# EAGLE design Comm&Log (EAGLE 9.6.2)
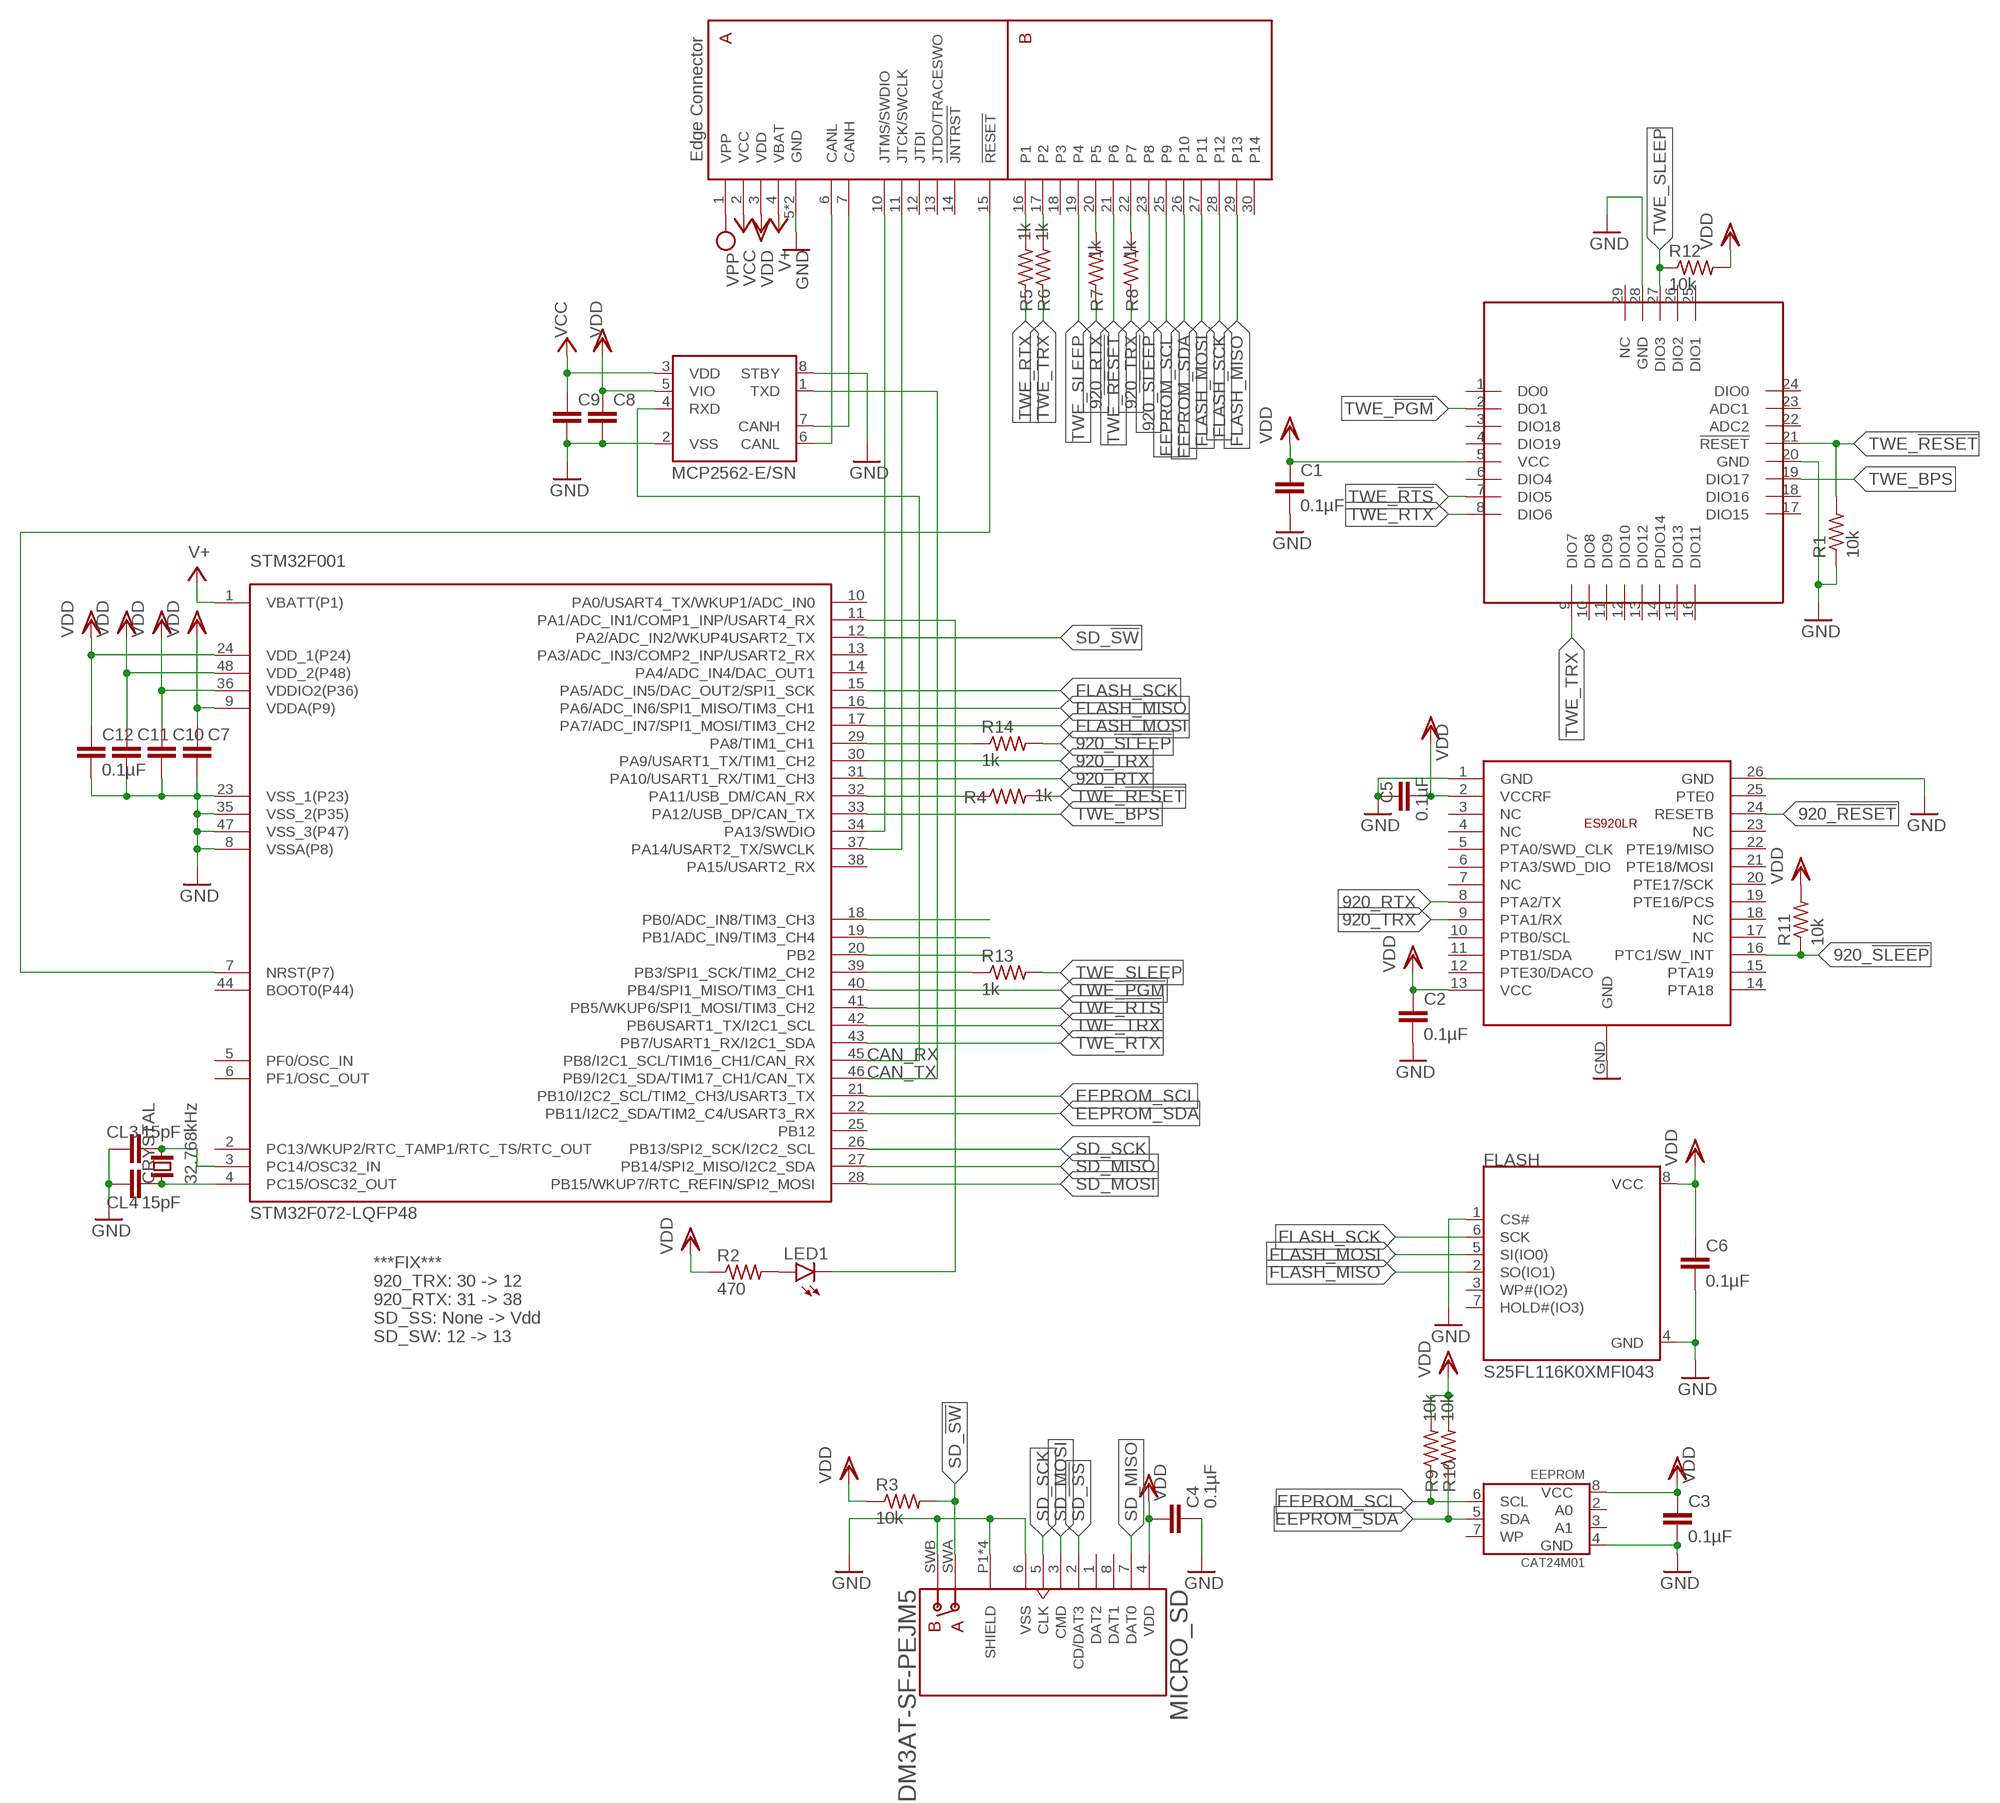
[diagram p0: schematic, sheet 1]

## Parts
C1  0.1µF  C-EUC0603K  [C0603K]
C2  0.1µF  C-EUC0603K  [C0603K]
C3  0.1µF  C-EUC0603K  [C0603K]
C4  0.1µF  C-EUC0603K  [C0603K]
C5  0.1µF  C-EUC0603K  [C0603K]
C6  0.1µF  C-EUC0603K  [C0603K]
C7  C-EUC0603K  [C0603K]
C8  C-EUC0603K  [C0603K]
C9  C-EUC0603K  [C0603K]
C10  C-EUC0603K  [C0603K]
C11  C-EUC0603K  [C0603K]
C12  0.1µF  C-EUC0603K  [C0603K]
CL3  15pF  C-EUC0603K  [C0603K]
CL4  15pF  C-EUC0603K  [C0603K]
CRYSTAL  32.768kHz  CRYTALFC-255  [FC-255]
EEPROM  CAT24M01  [SO-8]
ES920LR  ES920LR  [ES920LR]
FLASH  S25FL116K0XMFI043  [SOIC127P600X175-8N]
LED1  LEDCHIP-LED0603  [CHIP-LED0603]
MCP1  MCP2562-E/SN  [SOIC127P600X175-8N]
MICRO_SD  DM3AT-SF-PEJM5  [HRS_DM3AT-SF-PEJM5]
R1  10k  R-US_R0603  [R0603]
R2  470  R-US_R0603  [R0603]
R3  10k  R-US_R0603  [R0603]
R4  1k  R-US_R0603  [R0603]
R5  1k  R-US_R0603  [R0603]
R6  1k  R-US_R0603  [R0603]
R7  1k  R-US_R0603  [R0603]
R8  1k  R-US_R0603  [R0603]
R9  10k  R-US_R0603  [R0603]
R10  10k  R-US_R0603  [R0603]
R11  10k  R-US_R0603  [R0603]
R12  10k  R-US_R0603  [R0603]
R13  1k  R-US_R0603  [R0603]
R14  1k  R-US_R0603  [R0603]
STM32F001  STM32F072-LQFP48  [LQFP48]
TWE-LITE  LITE  [LITE]
U$2  EDGE30  [EDGE30]

## Nets
920_!RESET!: ES920LR.24(RESETB)
920_!SLEEP!: ES920LR.16(PTC1/SW_INT) R11.1 R14.2 U$2.23(P8)
920_!SLEEP!': R14.1 STM32F001.29(PA8/TIM1_CH1)
920_RTX: ES920LR.8(PTA2/TX) R7.1 STM32F001.31(PA10/USART1_RX/TIM1_CH3)
920_RTX_: R7.2 U$2.20(P5)
920_TRX: ES920LR.9(PTA1/RX) R8.1 STM32F001.30(PA9/USART1_TX/TIM1_CH2)
920_TRX_: R8.2 U$2.22(P7)
CAN_RX: MCP1.4(RXD) STM32F001.45(PB8/I2C1_SCL/TIM16_CH1/CAN_RX)
CAN_TX: MCP1.1(TXD) STM32F001.46(PB9/I2C1_SDA/TIM17_CH1/CAN_TX)
CANH1: MCP1.7(CANH) U$2.7(CANH)
CANL1: MCP1.6(CANL) U$2.6(CANL)
EEPROM_SCL: EEPROM.6(SCL) R9.1 STM32F001.21(PB10/I2C2_SCL/TIM2_CH3/USART3_TX) U$2.25(P9)
EEPROM_SDA: EEPROM.5(SDA) R10.1 STM32F001.22(PB11/I2C2_SDA/TIM2_C4/USART3_RX) U$2.26(P10)
FLASH_MISO: FLASH.2(SO(IO1)) STM32F001.16(PA6/ADC_IN6/SPI1_MISO/TIM3_CH1) U$2.29(P13)
FLASH_MOSI: FLASH.5(SI(IO0)) STM32F001.17(PA7/ADC_IN7/SPI1_MOSI/TIM3_CH2) U$2.27(P11)
FLASH_SCK: FLASH.6(SCK) STM32F001.15(PA5/ADC_IN5/DAC_OUT2/SPI1_SCK) U$2.28(P12)
GND: C1.2 C2.2 C3.2 C4.2 C5.1 C6.2 C7.2 C8.2 C9.2 C10.2 C11.2 C12.2 CL3.1 CL4.1 EEPROM.4(GND) ES920LR.1(GND) ES920LR.26(GND) ES920LR.GND FLASH.1(CS#) FLASH.4(GND) MCP1.2(VSS) MCP1.8(STBY) MICRO_SD.6(VSS) MICRO_SD.P1(SHIELD) MICRO_SD.P2(SHIELD) MICRO_SD.P3(SHIELD) MICRO_SD.P4(SHIELD) MICRO_SD.SWB(B) R1.1 STM32F001.8(VSSA(P8)) STM32F001.23(VSS_1(P23)) STM32F001.35(VSS_2(P35)) STM32F001.47(VSS_3(P47)) TWE-LITE.20(GND) TWE-LITE.28(GND) U$2.5(GND) U$2.8(GND)
N$3: R4.1 STM32F001.32(PA11/USB_DM/CAN_RX)
N$4: R6.2 U$2.17(P2)
N$6: R13.1 STM32F001.39(PB3/SPI1_SCK/TIM2_CH2)
N$62: STM32F001.18(PB0/ADC_IN8/TIM3_CH3)
N$63: STM32F001.19(PB1/ADC_IN9/TIM3_CH4)
N$64: STM32F001.20(PB2)
N$71: CL4.2 CRYSTAL.1 STM32F001.4(PC15/OSC32_OUT)
N$72: CL3.2 CRYSTAL.2 STM32F001.3(PC14/OSC32_IN)
N$73: LED1.C STM32F001.11(PA1/ADC_IN1/COMP1_INP/USART4_RX)
N$74: R5.2 U$2.16(P1)
N$76: LED1.A R2.2
NRST1: STM32F001.7(NRST(P7)) U$2.15(!RESET!)
SD_!SS!: MICRO_SD.2(CD/DAT3)
SD_!SW!: MICRO_SD.SWA(A) R3.2 STM32F001.12(PA2/ADC_IN2/WKUP4USART2_TX)
SD_MISO: MICRO_SD.7(DAT0) STM32F001.27(PB14/SPI2_MISO/I2C2_SDA)
SD_MOSI: MICRO_SD.3(CMD) STM32F001.28(PB15/WKUP7/RTC_REFIN/SPI2_MOSI)
SD_SCK: MICRO_SD.5(CLK) STM32F001.26(PB13/SPI2_SCK/I2C2_SCL)
SWCLK1: STM32F001.37(PA14/USART2_TX/SWCLK) U$2.11(JTCK/SWCLK)
SWDIO1: STM32F001.34(PA13/SWDIO) U$2.10(JTMS/SWDIO)
TWE_!PGM!: STM32F001.40(PB4/SPI1_MISO/TIM3_CH1) TWE-LITE.2(DO1)
TWE_!RESET!: R1.2 R4.2 TWE-LITE.21(!RESET!) U$2.21(P6)
TWE_!RTS!: STM32F001.41(PB5/WKUP6/SPI1_MOSI/TIM3_CH2) TWE-LITE.7(DIO5)
TWE_BPS: STM32F001.33(PA12/USB_DP/CAN_TX) TWE-LITE.19(DIO17)
TWE_RTX: R5.1 STM32F001.43(PB7/USART1_RX/I2C1_SDA) TWE-LITE.8(DIO6)
TWE_SLEEP: R12.1 R13.2 TWE-LITE.27(DIO3) U$2.19(P4)
TWE_TRX: R6.1 STM32F001.42(PB6USART1_TX/I2C1_SCL) TWE-LITE.9(DIO7)
VBAT: STM32F001.1(VBATT(P1)) U$2.4(VBAT) ; supply symbol labelled V+
VCC: C9.1 MCP1.3(VDD) U$2.2(VCC)
VDD: C1.1 C2.1 C3.1 C4.1 C5.2 C6.1 C7.1 C8.1 C10.1 C11.1 C12.1 EEPROM.8(VCC) ES920LR.2(VCCRF) ES920LR.13(VCC) FLASH.8(VCC) MCP1.5(VIO) MICRO_SD.4(VDD) R2.1 R3.1 R9.2 R10.2 R11.2 R12.2 STM32F001.9(VDDA(P9)) STM32F001.24(VDD_1(P24)) STM32F001.36(VDDIO2(P36)) STM32F001.48(VDD_2(P48)) TWE-LITE.5(VCC) U$2.3(VDD)
VPP: U$2.1(VPP)
Unconnected: EEPROM.2(A0) EEPROM.3(A1) EEPROM.7(WP) ES920LR.3(NC) ES920LR.4(NC) ES920LR.5(PTA0/SWD_CLK) ES920LR.6(PTA3/SWD_DIO) ES920LR.7(NC) ES920LR.10(PTB0/SCL) ES920LR.11(PTB1/SDA) ES920LR.12(PTE30/DACO) ES920LR.14(PTA18) ES920LR.15(PTA19) ES920LR.17(NC) ES920LR.18(NC) ES920LR.19(PTE16/PCS) ES920LR.20(PTE17/SCK) ES920LR.21(PTE18/MOSI) ES920LR.22(PTE19/MISO) ES920LR.23(NC) ES920LR.25(PTE0) FLASH.3(WP#(IO2)) FLASH.7(HOLD#(IO3)) MICRO_SD.1(DAT2) MICRO_SD.8(DAT1) STM32F001.2(PC13/WKUP2/RTC_TAMP1/RTC_TS/RTC_OUT) STM32F001.5(PF0/OSC_IN) STM32F001.6(PF1/OSC_OUT) STM32F001.10(PA0/USART4_TX/WKUP1/ADC_IN0) STM32F001.13(PA3/ADC_IN3/COMP2_INP/USART2_RX) STM32F001.14(PA4/ADC_IN4/DAC_OUT1) STM32F001.25(PB12) STM32F001.38(PA15/USART2_RX) STM32F001.44(BOOT0(P44)) TWE-LITE.1(DO0) TWE-LITE.3(DIO18) TWE-LITE.4(DIO19) TWE-LITE.6(DIO4) TWE-LITE.10(DIO8) TWE-LITE.11(DIO9) TWE-LITE.12(DIO10) TWE-LITE.13(DIO12) TWE-LITE.14(PDIO14) TWE-LITE.15(DIO13) TWE-LITE.16(DIO11) TWE-LITE.17(DIO15) TWE-LITE.18(DIO16) TWE-LITE.22(ADC2) TWE-LITE.23(ADC1) TWE-LITE.24(DIO0) TWE-LITE.25(DIO1) TWE-LITE.26(DIO2) TWE-LITE.29(NC) U$2.12(JTDI) U$2.13(JTDO/TRACESWO) U$2.14(!JNTRST!) U$2.18(P3) U$2.30(P14)

## Notes on the sheet
- ***FIX***
  920_TRX: 30 -> 12
  920_RTX: 31 -> 38
  SD_SS: None -> Vdd
  SD_SW: 12 -> 13

## Library data of the parts
C1-C12 CL3 CL4 = rcl:C-EU: CAPACITOR, European symbol; SPICEPREFIX: C
CRYSTAL = crystal':CRYTAL: CRYSTAL
EEPROM = CAT24M01:CAT24M01: 1Mb I2C CMOS EEPROM; AVAILABILITY: Unavailable; DESCRIPTION: ON Semiconductor 1MB I2C SERIAL EEPROM; MF: ON Semiconductor; MP: CAT24M01; PACKAGE: SOIC-8 ON Semiconductor; PRICE: None
ES920LR = FaBo-LoRa:ES920LR
FLASH = S25FL116K0XMFI043:S25FL116K0XMFI043: S25FL116K Series 16 Mb (2 M x 8) 2.7 V Surface Mount Flash Memory - SOIC-8; AVAILABILITY: Unavailable; DESCRIPTION: Tape And Reel / Cmos 3.0 Volt Flash Memory Serial Peripheral Interface _Spi_ With Multi-i/o; MF: Cypress Semiconductor; MP: S25FL116K0XMFI043; PACKAGE: SOIC-8 Spansion; PRICE: None
LED1 = led:LED: LED OSRAM: - CHIPLED LG R971, LG N971, LY N971, LG Q971, LY Q971, LO R971, LY R971 LH N974, LH R974 LS Q976, LO Q976, LY Q976 LO Q996 - Hyper CHIPLED LW Q18S LB Q993, LB Q99A, LB R99A - SideLED LS A670, LO A670, LY A670, LG A670, LP A670 LB A673, LV A673, LT A673, LW A673 LH A674 LY A675 LS A676, LA A676, LO A676, LY A676, LW A676 LS A679, LY A679, LG A679 - Hyper Micro SIDELED® LS Y876, LA Y876, LO Y876, LY Y876 LT Y87S - SmartLED LW L88C, LW L88S LB L89C, LB L89S, LG L890 LS L89K, LO L89K, LY L89K LS L896, LA L896, LO L896, LY L896 - TOPLED LS T670, LO T670, LY T670, LG T670, LP T670 LSG T670, LSP T670, LSY T670, LOP T670, LYG T670 LG T671, LOG T671, LSG T671 LB T673, LV T673, LT T673, LW T673 LH T674 LS T676, LA T676, LO T676, LY T676, LB T676, LH T676, LSB T676, LW T676 LB T67C, LV T67C, LT T67C, LS T67K, LO T67K, LY T67K, LW E67C LS E67B, LA E67B, LO E67B, LY E67B, LB E67C, LV E67C, LT E67C LW T67C LS T679, LY T679, LG T679 LS T770, LO T770, LY T770, LG T770, LP T770 LB T773, LV T773, LT T773, LW T773 LH T774 LS E675, LA E675, LY E675, LS T675 LS T776, LA T776, LO T776, LY T776, LB T776 LHGB T686 LT T68C, LB T68C - Hyper Mini TOPLED® LB M676 - Mini TOPLED Santana® LG M470 LS M47K, LO M47K, LY M47K Source: http://www.osram.convergy.de LUXEON: - LUMILED® LXK2-PW12-R00, LXK2-PW12-S00, LXK2-PW14-U00, LXK2-PW14-V00 LXK2-PM12-R00, LXK2-PM12-S00, LXK2-PM14-U00 LXK2-PE12-Q00, LXK2-PE12-R00, LXK2-PE12-S00, LXK2-PE14-T00, LXK2-PE14-U00 LXK2-PB12-K00, LXK2-PB12-L00, LXK2-PB12-M00, LXK2-PB14-N00, LXK2-PB14-P00, LXK2-PB14-Q00 LXK2-PR12-L00, LXK2-PR12-M00, LXK2-PR14-Q00, LXK2-PR14-R00 LXK2-PD12-Q00, LXK2-PD12-R00, LXK2-PD12-S00 LXK2-PH12-R00, LXK2-PH12-S00 LXK2-PL12-P00, LXK2-PL12-Q00, LXK2-PL12-R00 Source: www.luxeon.com KINGBRIGHT: KA-3528ASYC Source: www.kingbright.com
MCP1 = mcp2562-E_SN:MCP2562-E/SN: MCP2562 Series 5 V Surface Mount High-Speed CAN Transceiver - SOIC-8; AVAILABILITY: Unavailable; DESCRIPTION: Microchip MCP2562-E/SN, CAN Transceiver 1MBps 1-channel IEC 61000-4-2, 8-Pin SOIC; MF: Microchip; MP: MCP2562-E/SN; PACKAGE: SO-8 Microchip; PRICE: None
MICRO_SD = dm3at-sf-pejm5:DM3AT-SF-PEJM5: DM3 Series 8 Position Right Angle SMT Push Push Ejection MicroSD Card Connector; DESCRIPTION: DM3 RA SMT microSD memory card push/push; DIGI-KEY_PART_NUMBER: HR1964CT-ND; DIGI-KEY_PURCHASE_URL: https://www.digikey.jp/product-detail/en/hirose-electric-co-ltd/DM3AT-SF-PEJM5/HR1964CT-ND/2533566?utm_source=snapeda&utm_medium=aggregator&utm_campaign=symbol; MF: Hirose; MP: DM3AT-SF-PEJM5; PACKAGE: None
R1-R8 = rcl:R-US_: RESISTOR, American symbol; SPICEPREFIX: R
R9-R14 = resistor:R-US_: RESISTOR, American symbol
STM32F001 = stm32f0:STM32F072
TWE-LITE = TWELite:LITE
U$2 = bus:EDGE30

## Board
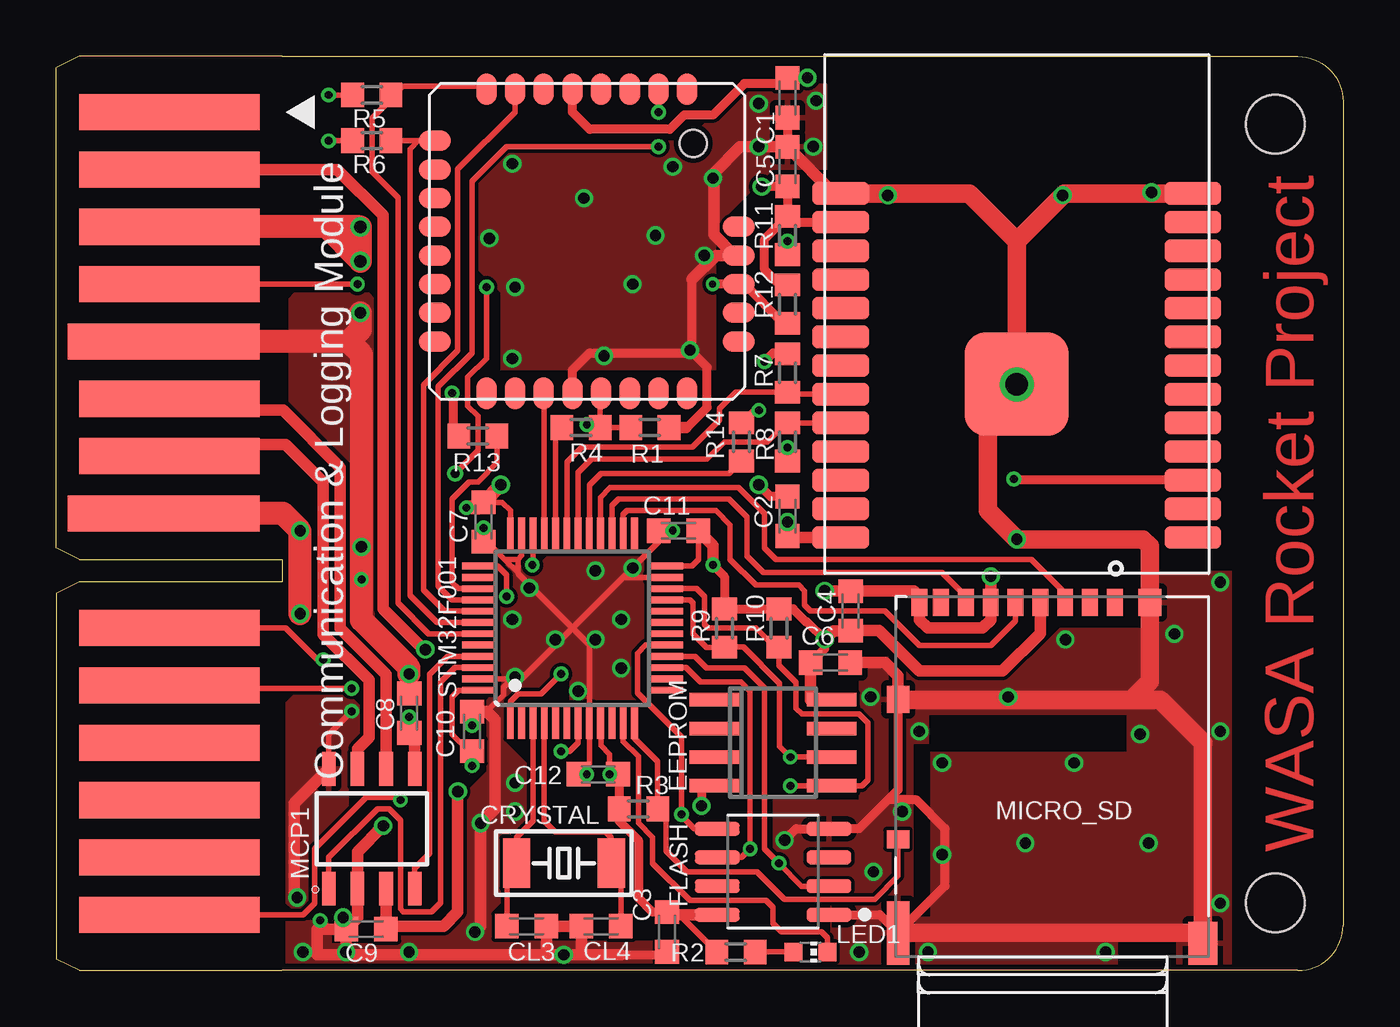
[diagram p1: board, top side]
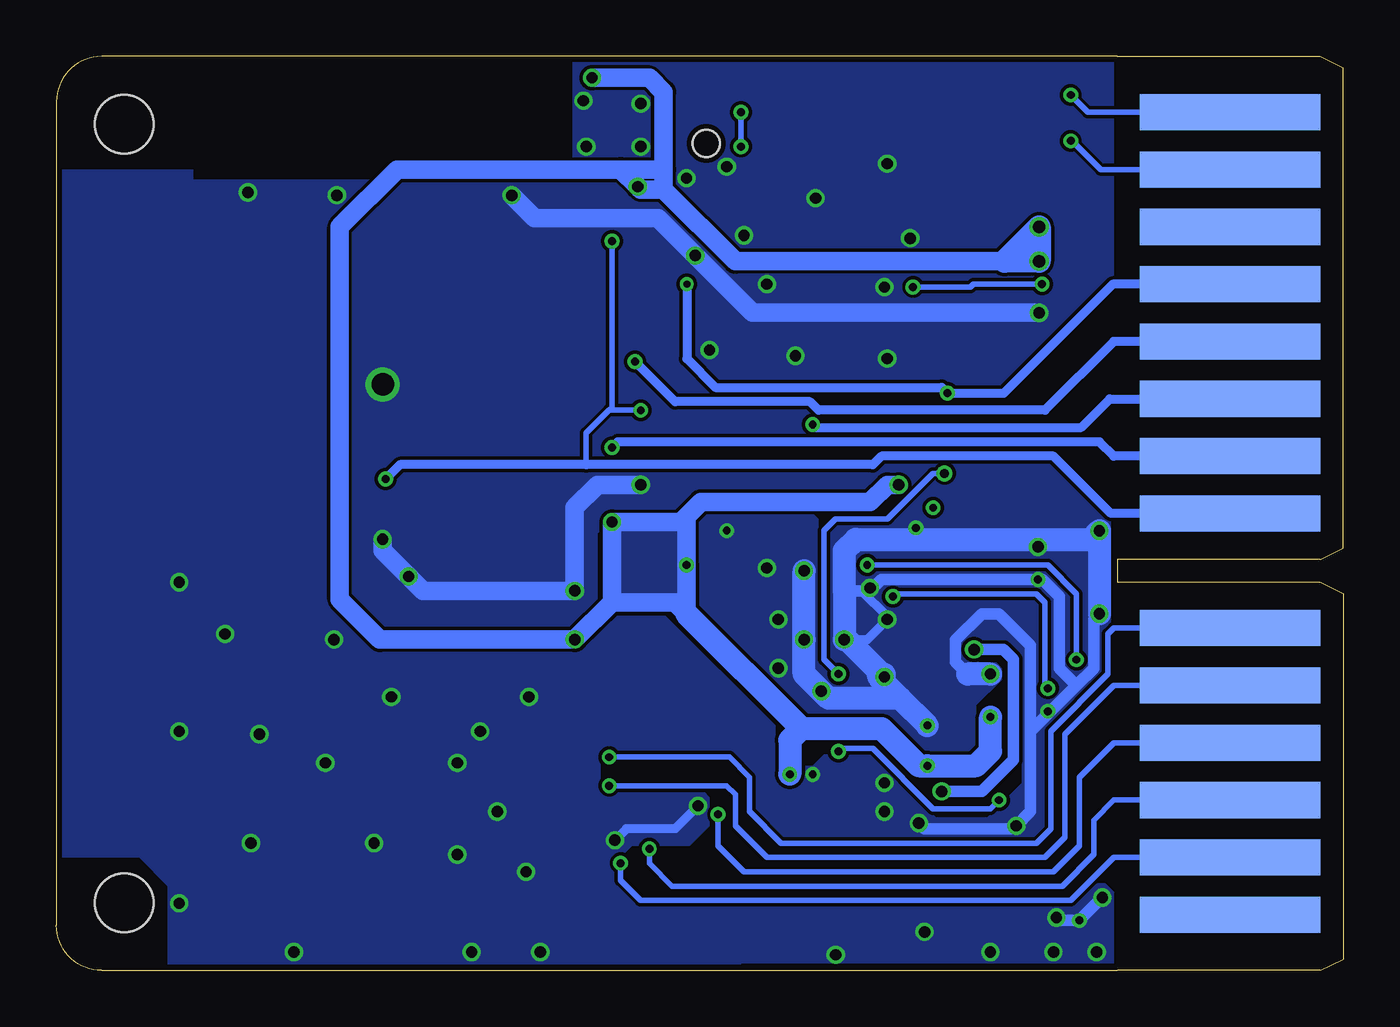
[diagram p2: board, bottom side, seen from below]

Size 57 x 40.5 mm. Coordinates in mm from the lower left corner, seen from the top.
Outline: 10,40.5 55,40.5 arc-90 57,38.5 57,2 arc-90 55,0 10,0
Copper layers (1*16): Top 0.035mm / dielectric 1.5mm / Bottom 0.035mm
Design rules "SeeedStudio_2layer_DRU_no_angle_20140221": minimum track width 6mil, minimum drill 12mil, track to track 6mil, track to pad 6mil, pad to pad 6mil, via to via 6mil, smd to smd 0mil, copper to edge 10mil, drill to drill 10mil, minimum pad ring 10mil, minimum via ring 6mil, stop-mask expansion 2mil, vias tented up to drill 100mil, thermal gap 10mil
Holes 2.6 mm at 54,3 54,37.5

### Footprints (pad centres in the part's own frame; a part is rotated, then mirrored left to right if it is on the bottom)
C0603K = smd 1.05 x 1.08: 1 -0.875,0; 2 0.875,0
FC-255 = smd 1.2 x 2.2: 1 -2.1,0; 2 2.1,0
SO-8 = smd 2.2 x 0.6: 1 -2.6,1.905; 2 -2.6,0.635; 3 -2.6,-0.635; 4 -2.6,-1.905; 5 2.6,-1.905; 6 2.6,-0.635; 7 2.6,0.635; 8 2.6,1.905
ES920LR = smd 2.5 x 1: 1 -7.8,5.84; 2 -7.8,4.57; 3 -7.8,3.3; 4 -7.8,2.03; 5 -7.8,0.76; 6 -7.8,-0.51; 7 -7.8,-1.78; 8 -7.8,-3.05; 9 -7.8,-4.32; 10 -7.8,-5.59; 11 -7.8,-6.86; 12 -7.8,-8.13; 13 -7.8,-9.4; 14 7.8,-9.4; 15 7.8,-8.13; 16 7.8,-6.86; 17 7.8,-5.59; 18 7.8,-4.32; 19 7.8,-3.05; 20 7.8,-1.78; 21 7.8,-0.51; 22 7.8,0.76; 23 7.8,2.03; 24 7.8,3.3; 25 7.8,4.57; 26 7.8,5.84 | smd 4.6 x 4.6: GND 0,-2.6
SOIC127P600X175-8N = smd 1.97 x 0.6: 1 -2.475,1.905; 2 -2.475,0.635; 3 -2.475,-0.635; 4 -2.475,-1.905; 5 2.475,-1.905; 6 2.475,-0.635; 7 2.475,0.635; 8 2.475,1.905
CHIP-LED0603 = smd 0.8 x 0.8: A 0,-0.75; C 0,0.75
SOIC127P600X175-8N' = smd 1.5 x 0.6: 1 -2.65,1.905; 2 -2.65,0.635; 3 -2.65,-0.635; 4 -2.65,-1.905; 5 2.65,-1.905; 6 2.65,-0.635; 7 2.65,0.635; 8 2.65,1.905
HRS_DM3AT-SF-PEJM5 = smd 0.7 x 1.2: 1 3.2,0; 2 2.1,0; 3 1,0; 4 -0.1,0; 5 -1.2,0; 6 -2.3,0; 7 -3.4,0; 8 -4.5,0; SWB -5.45,0 | smd 1 x 1.2: P1 -6.4,-4.3; P4 4.75,0 | smd 1 x 2.8: P2 -6.4,-14.65 | smd 1.3 x 1.9: P3 7.1,-15.1 | smd 1 x 0.8: SWA -6.4,-10.5
R0603 = smd 1 x 1.1: 1 -0.85,0; 2 0.85,0
LQFP48 = smd 1.5 x 0.3: 1 -4.15,2.75; 2 -4.15,2.25; 3 -4.15,1.75; 4 -4.15,1.25; 5 -4.15,0.75; 6 -4.15,0.25; 7 -4.15,-0.25; 8 -4.15,-0.75; 9 -4.15,-1.25; 10 -4.15,-1.75; 11 -4.15,-2.25; 12 -4.15,-2.75; 25 4.15,-2.75; 26 4.15,-2.25; 27 4.15,-1.75; 28 4.15,-1.25; 29 4.15,-0.75; 30 4.15,-0.25; 31 4.15,0.25; 32 4.15,0.75; 33 4.15,1.25; 34 4.15,1.75; 35 4.15,2.25; 36 4.15,2.75 | smd 0.3 x 1.5: 13 -2.75,-4.15; 14 -2.25,-4.15; 15 -1.75,-4.15; 16 -1.25,-4.15; 17 -0.75,-4.15; 18 -0.25,-4.15; 19 0.25,-4.15; 20 0.75,-4.15; 21 1.25,-4.15; 22 1.75,-4.15; 23 2.25,-4.15; 24 2.75,-4.15; 37 2.75,4.15; 38 2.25,4.15; 39 1.75,4.15; 40 1.25,4.15; 41 0.75,4.15; 42 0.25,4.15; 43 -0.25,4.15; 44 -0.75,4.15; 45 -1.25,4.15; 46 -1.75,4.15; 47 -2.25,4.15; 48 -2.75,4.15
LITE = smd 1.4 x 0.9: 1 0.25,11.43; 2 0.25,10.16; 3 0.25,8.89; 4 0.25,7.62; 5 0.25,6.35; 6 0.25,5.08; 7 0.25,3.81; 8 0.25,2.54; 17 13.72,2.54; 18 13.72,3.81; 19 13.72,5.08; 20 13.72,6.35; 21 13.72,7.62; 22 13.72,8.89; 23 13.72,10.16; 24 13.72,11.43 | smd 0.9 x 1.4: 9 2.54,0.25; 10 3.81,0.25; 11 5.08,0.25; 12 6.35,0.25; 13 7.62,0.25; 14 8.89,0.25; 15 10.16,0.25; 16 11.43,0.25; 25 11.43,13.72; 26 10.16,13.72; 27 8.89,13.72; 28 7.62,13.72; 29 6.35,13.72 | hole 1.2: 2.65,11.7
EDGE30 = smd 1.6 x 8: 1 -17.78,-5; 2 -15.24,-5; 3 -12.7,-5; 4 -10.16,-5; 6 -5.08,-5; 7 -2.54,-5; 10 5.08,-5; 11 7.62,-5; 12 10.16,-5; 13 12.7,-5; 14 15.24,-5; 15 17.78,-5 | smd 1.6 x 8.5: 5 -7.62,-5.25; 8 0,-5.25 | smd 1.6 x 8 bottom: 16 -17.78,-5; 17 -15.24,-5; 18 -12.7,-5; 19 -10.16,-5; 20 -7.62,-5; 21 -5.08,-5; 22 -2.54,-5; 23 0,-5; 25 5.08,-5; 26 7.62,-5; 27 10.16,-5; 28 12.7,-5; 29 15.24,-5; 30 17.78,-5

### Placement (x,y rotation side)
C1  32.38,38.66 270 top
C2  32.38,20.12 90 top
C3  27.05,1.71 270 top
C4  35.18,15.93 90 top
C5  32.38,35.62 270 top
C6  34.29,13.65 0 top
C7  18.92,19.87 270 top
C8  15.63,11.41 90 top
C9  13.72,1.84 180 top
C10  18.41,10.6 90 top
C11  27.56,19.49 180 top
C12  24,8.69 180 top
CL3  20.83,1.96 180 top
CL4  24.13,1.96 0 top
CRYSTAL  22.48,4.76 180 top
EEPROM  31.75,10.09 0 top
ES920LR  42.55,28.59 0 top
FLASH  31.75,4.38 180 top
LED1  33.4,0.82 270 top
MCP1  MCP2562-E/SN  [SOIC127P600X175-8N']  13.97,6.28 90 top
MICRO_SD  43.69,16.31 0 top
R1  26.29,24.06 180 top
R2  30.1,0.82 0 top
R3  25.78,7.17 0 top
R4  23.24,24.06 0 top
R5  13.97,38.79 180 top
R6  13.97,36.76 180 top
R7  32.38,26.47 90 top
R8  32.38,23.43 270 top
R9  29.59,15.17 90 top
R10  32,15.17 90 top
R11  32.38,32.57 90 top
R12  32.38,29.52 90 top
R13  18.67,23.68 180 top
R14  30.35,23.43 90 top
STM32F001  22.86,15.17 90 top
TWE-LITE  16.51,39.3 270 top
U$2  10,20.25 270 top

### Tracks (layer width: path | path; a pad name or v marks a point on that pad's centre or on a via)
920_!SLEEP!  (via drill 0.35)
  Top 0.254: 42.47,21.73 v42.42,21.77 | R14.2 30.9,24.82 v31.11,24.82 | R11.1 v32.38,32.31
  Top 0.406: ES920LR.16 42.47,21.73
  Bottom 0.254: v31.11,24.82 32.51,24.82 | 32.51,24.82 33.53,23.81 33.53,22.41 | 32.51,24.82 32.38,24.95 v32.38,32.31
  Bottom 0.406: v42.42,21.77 41.78,22.41 33.53,22.41 20.83,22.41 20.45,22.79 12.83,22.79 10.29,20.25 U$2.23
920_!SLEEP!'
  Top 0.254: R14.1 29.81,22.03 24.13,22.03 23.61,21.51 STM32F001.29
920_RTX
  Top 0.254: STM32F001.31 22.61,22.52 23.29,23.2 28.18,23.2 29.38,24.39 29.38,24.9 30.1,25.62 R7.1 32.47,25.54 ES920LR.8
920_RTX_  (via drill 0.35)
  Top 0.406: R7.2 32.35,27.36 31.75,27.36 v31.37,26.98
  Bottom 0.406: U$2.20 10.16,27.87 13.21,24.82 23.24,24.82 23.62,25.2 29.59,25.2 v31.37,26.98
920_TRX
  Top 0.254: STM32F001.30 23.11,22.07 23.71,22.66 28.83,22.66 29.59,23.43 31.49,23.43 32.34,24.27 R8.1 32.4,24.27 ES920LR.9
920_TRX_  (via drill 0.35)
  Top 0.254: v32.38,23.17 R8.2
  Bottom 0.406: U$2.22 10.16,22.79 10.79,23.43 32.13,23.43 v32.38,23.17
CAN_RX
  Top 0.254: STM32F001.45 17.33,13.92 16.54,13.13 16.54,5.18 15.88,4.52 MCP1.4
CAN_TX
  Top 0.254: STM32F001.46 17.66,13.42 17.02,12.78 17.02,3 16.61,2.6 15.37,2.6 15.24,2.72 15.24,6.66 14.73,7.17 14.22,7.17 12.06,5.01 MCP1.1
CANH1
  Top 0.508: MCP1.7 13.34,9.82 13.84,10.33 13.84,12.87 11.81,14.9 11.81,21.65 10.16,23.3 5.51,23.3 U$2.7
CANL1
  Top 0.508: MCP1.6 14.61,13.12 12.57,15.15 12.57,22.28 10.03,24.82 5.51,24.82 U$2.6
EEPROM_SCL  (via drill 0.35)
  Top 0.254: STM32F001.21 28.06,16.42 28.19,16.29 28.19,14.92 28.79,14.32 R9.1 30.43,14.33 32.04,12.72 32.04,9.93 v32.51,9.46 EEPROM.6
  Bottom 0.254: U$2.25 10.16,15.17 10.41,14.92 10.41,13.14 12.95,10.6 12.95,6.28 13.59,5.64 24.89,5.64 26.29,7.04 26.29,8.57 27.18,9.46 v32.51,9.46
EEPROM_SDA  (via drill 0.35)
  Top 0.254: STM32F001.22 28.35,16.92 28.7,16.57 28.7,15.34 28.87,15.17 30.99,15.17 31.84,14.32 R10.1 32,13.52 32.77,12.76 32.77,11.61 33.02,11.36 35.56,11.36 35.94,10.98 35.94,8.44 35.69,8.19 EEPROM.5 v32.51,8.19
  Bottom 0.254: U$2.26 10.16,12.63 12.32,10.47 12.32,5.9 13.21,5.01 25.53,5.01 26.92,6.41 26.92,7.8 27.3,8.19 v32.51,8.19
FLASH_MISO  (via drill 0.35)
  Top 0.254: STM32F001.16 28.28,13.92 28.79,13.41 30.47,13.41 31.37,12.52 31.37,5.39 v32,4.76 v32,4.75 33.01,3.74 FLASH.2
  Bottom 0.254: U$2.29 10.16,5.01 12.06,3.11 31.11,3.11 32,3.99 v32,4.76
FLASH_MOSI  (via drill 0.35)
  Top 0.254: STM32F001.17 26.1,14.42 25.73,14.05 25.73,12.3 27.69,10.34 v27.69,6.91 27.69,6.85 28.26,6.28 FLASH.5
  Bottom 0.254: U$2.27 10.16,10.09 11.68,8.57 11.68,5.52 12.83,4.38 26.54,4.38 27.69,5.52 v27.69,6.91
FLASH_SCK  (via drill 0.35)
  Top 0.254: STM32F001.15 27.9,13.42 28.53,12.79 30.32,12.79 30.73,12.37 v30.73,5.39 v30.73,5.38 30.36,5.01 FLASH.6
  Bottom 0.254: U$2.28 10.16,7.55 11.05,6.66 11.05,5.14 12.45,3.74 29.72,3.74 30.73,4.76 v30.73,5.39
GND  (via drill 0.35, 0.5, 1)
  Top 0.254: STM32F001.35 20.61,18.38 20.45,18.22 | 20.45,17.63 20.45,18.22 | STM32F001.47 20.19,12.92 | 20.19,12.92 20.61,12.92 22.86,15.17 | 22.86,15.17 20.45,17.58 20.45,17.63 | 22.86,15.17 23.61,14.42 STM32F001.8 23.61,9.97 23.62,9.96 23.62,9.19 C12.2 | STM32F001.23 25.11,17.42 | 22.86,15.17 25.11,17.42 | 19.16,11.47 19.06,11.47 19.81,12.22 19.81,12.54 20.19,12.92 | C7.2 19.18,18.74 19.34,18.74 19.86,18.22 | 20.45,18.22 19.86,18.22 | 19.86,18.22 20.45,17.63 | 25.11,17.42 v25.53,17.84 26.68,18.99 C11.2 | MCP1.8 12.06,10.47 v13.08,11.49
  Top 0.406: C2.2 31.64,21 v31.11,21.52 | 27.88,24.06 27.94,24.06 28.83,24.95 28.83,26.73 28.16,27.39 | 28.16,27.39 28.16,30.63 | TWE-LITE.20 22.86,26.6 23.62,27.36 28.13,27.36 28.16,27.39 | C1.2 C5.1 | FLASH.1 36.48,2.47 MICRO_SD.P2 39.37,3.75 39.37,6.28 38.1,7.55 36.83,7.55 | 36.83,7.55 35.56,6.28 FLASH.4 32.77,6.28 v32.26,5.77 | MICRO_SD.P1 37.29,8.01 36.83,7.55 | EEPROM.4 28.57,8.19 v28.57,7.3 | 25.02,0.69 26.91,0.69 C3.2
  Top 0.508: C9.2 13.34,2.33 MCP1.2 13.34,5.26 v14.48,6.41 | 12.84,0.95 13.1,0.69 v22.48,0.69 | C9.2 12.84,0.95 | v18.54,1.71 18.8,1.96 v18.8,6.53 19.43,7.17 19.43,11.11 19.06,11.47 C10.2 v18.41,10.85 | v15.62,13.14 v15.63,13.13 C8.2 | v18.92,19.61 C7.2 | v27.3,19.49 C11.2 | v22.48,0.69 23.25,0.69 CL4.1 CL3.1 21.7,0.69 v22.48,0.69 | 25.02,0.69 23.24,0.69 23.25,0.71 | C9.2 11.56,1.84 11.56,0.69 12.59,0.69 12.84,0.95 | MCP1.8 10.54,7.41 10.54,3.36 v10.67,3.23 | C6.2 36.7,13.65 37.29,13.06 MICRO_SD.P1 | v34.04,16.82 34.05,16.81 C4.2 38,16.81 38.24,16.57 MICRO_SD.SWB 38.24,15.54 38.61,15.17 41.02,15.17 41.39,15.54 MICRO_SD.6 41.39,17.44 v41.4,17.46 | ES920LR.1 34.45,34.42 C5.1 30.28,36.49 29.12,35.34 29.12,32.59 30.04,31.68 TWE-LITE.28 29.21,31.68 28.16,30.63 | R1.1 27.88,24.06
  Top 0.813: ES920LR.26 44.66,34.42 v44.58,34.35 42.55,32.31 | 42.55,32.31 v42.55,25.96 | ES920LR.1 36.83,34.42 | 36.83,34.42 40.44,34.42 42.55,32.31 | MICRO_SD.P1 37.31,11.99 47.62,11.99 | 47.62,11.99 48.44,12.81 MICRO_SD.P4 48.44,18.8 48.13,19.11 v42.55,19.11 41.27,20.38 41.27,24.7 v42.55,25.96 | 47.62,11.99 48.9,11.99 50.8,10.09 50.79,10.08 MICRO_SD.P3 50.34,1.66 MICRO_SD.P2 | v36.83,34.35 36.83,34.42 | ES920LR.GND v42.55,25.96
  Top 1.016: U$2.8 10.03,20.25 v10.79,19.49 v10.79,15.8 | 12.95,27.87 U$2.5 | v15.62,13.14 15.62,13.42 13.51,15.53 v13.51,17.32 v13.51,18.77 13.51,27.31 12.95,27.87 | v13.46,29.14 13.46,28.38 12.95,27.87
  Bottom 0.406: v28.57,7.3 29.59,6.28 31.75,6.28 v32.26,5.77 | v22.1,14.66 21.08,14.66 v20.19,15.55 20.19,15.68 21.34,16.82
  Bottom 0.508: 16.64,13.14 17.17,13.67 17.17,14.64 16,15.8 15.24,15.8 13.84,14.41 13.84,10.6 | 13.84,10.6 13.84,7.04 v14.48,6.41 14.61,6.28 18.54,6.28 v18.8,6.53 | 13.84,10.6 11.81,12.63 | 11.81,12.63 11.05,13.39 11.05,15.55 v10.79,15.8 | 11.05,19.23 v10.79,19.49 | 22.1,16.82 21.34,16.82 20.95,16.82 20.46,17.32 v13.51,17.32 13.33,17.32 12.57,16.57 12.57,13.39 11.81,12.63 | v12.7,2.34 12.57,2.22 v11.68,2.22 v10.67,3.23
  Bottom 0.813: v31.11,21.52 33.02,21.52 34.04,20.5 v34.04,16.82 40.77,16.82 v41.4,17.46 42.55,18.6 v42.55,19.11 | v13.46,29.14 26.16,29.14 30.35,33.33 35.81,33.33 v36.83,34.35
  Bottom 1.016: v15.62,13.14 16.64,13.14 | 19.62,12.06 20.57,13.01 20.57,13.14 20.32,13.14 v20.32,13.01 21.97,14.66 v22.1,14.66 22.1,16.82 22.1,18.6 21.59,19.11 11.18,19.11 v10.79,19.49 v10.79,15.8 | 19.62,12.06 v18.41,10.85 | 19.62,12.06 22.8,12.06 v23.11,12.38 23.88,13.14 v23.88,14.66 v23.88,17.71
  other vias: 23.5,8.69 20.32,8.31 20.32,7.04 10.92,0.82 12.83,0.82 20.95,16.95 25.02,15.55 15.62,0.82 48.51,34.47 35.56,0.82 38.61,0.82 36.2,4.38 46.48,0.82 51.56,2.98 48.39,5.64 42.93,5.64 45.09,9.2 48.01,10.47 51.56,10.6 39.24,9.2 38.23,10.6 36.07,12.12 42.16,12.12 44.7,14.66 49.53,14.92 51.56,17.2 33.66,38.54 33.53,36.51 31.11,38.41 31.11,36.51 29.08,35.11 27.3,35.62 26.54,32.57 25.53,30.41 28.07,27.49 24.26,27.23 23.37,34.22 20.19,35.74 19.18,32.44 20.32,30.28 20.19,27.11 28.7,31.68 25.02,13.39 39.24,5.14 37.47,7.04
  pour Top: 19.68,17.96 19.68,13.14 26.04,13.14 26.04,17.96
  pour Top: 19.68,13.14 19.68,12.12 20.32,12.12 20.32,12.38 21.97,12.38 21.97,13.14
  pour Top: 22.86,13.14 22.73,13.14 22.73,12.5 22.73,11.99 26.04,11.99 26.04,13.14
  pour Bottom: 23.24,17.33 23.24,20 24.26,21.01 27.81,21.01 28.83,20 28.83,12.63 27.3,11.11 20.32,11.11 18.92,9.71 16.51,9.71 16.26,9.96 16.26,20.25 22.23,20.25 22.73,19.74 22.73,13.9
  pour Bottom: 16.26,13.77 16.13,13.65 15.88,13.65 15.49,13.65 15.37,13.65 15.11,13.39 15.11,13.01 15.11,12.88 16.26,11.74
  pour Bottom: 20.76,20.82 18.8,22.79 13.08,22.79 10.29,20 10.29,13.27 12.95,10.6 14.48,10.6 14.61,10.72 14.61,14.03 15.11,14.54 16.26,14.54 16.26,16.31
  pour Bottom: 13.21,5.9 23.11,5.9 24.89,7.68 22.99,9.58 20.83,9.58 18.03,6.79 15.75,6.79 14.22,8.31 14.22,11.23 13.21,11.23
  pour Top (no thermals): 26.42,1.33 26.42,0.31 14.86,0.31 14.86,2.09 19.43,2.09 19.43,1.33
  pour Top (no thermals): 19.94,12.12 19.81,11.99 19.81,10.22 20.95,9.07 20.95,6.79 19.68,5.52 19.68,2.98 19.3,2.6 19.3,2.09 17.91,2.09 17.91,2.22 18.03,2.34 18.03,7.8 19.05,8.82 19.05,11.99 19.18,12.12
  pour Top (no thermals): 14.99,0.31 10.16,0.31 10.16,2.22 11.94,2.22 12.19,1.96 12.19,1.2 14.99,1.2
  pour Top (no thermals): 21.21,17.58 21.21,17.84 21.72,18.34 26.04,18.34 26.04,17.71 21.34,17.71
  pour Top (no thermals): 13.84,15.8 13.84,15.93 13.84,25.2
  pour Bottom: 10.16,0.31 10.16,2.98 26.8,2.98 26.8,0.31
  pour Bottom: 13.84,0.31 10.79,0.31 10.41,0.69 10.41,1.07 10.67,1.33 13.84,1.33
  pour Bottom: 11.3,1.84 13.08,1.84 13.34,2.09 13.34,2.6 13.08,2.85 11.94,2.85 10.92,3.87 10.54,3.87 10.16,3.49 10.16,2.98
  pour Top: 10.41,2.72 10.79,2.72 11.18,3.11 11.18,5.52 12.95,7.3 12.95,9.96 13.59,10.6 13.59,11.61 12.95,12.25 10.54,12.25 10.16,11.87 10.16,2.98
  pour Top: 13.08,15.55 13.08,22.41 10.29,25.2 10.29,29.77 10.54,30.03 13.84,30.03 14.1,29.77 14.1,15.17 13.46,15.17
  pour Bottom (rank 2): 10.16,40.57 50.8,40.57 50.8,35.49 57.15,35.49 57.15,15.17 34.29,15.17 33.02,16.44 33.02,19.36 32.13,20.25 16.51,20.25 16.51,24.06 10.16,30.41
  pour Bottom (rank 2): 57.15,15.17 57.15,5.01 53.34,5.01 52.07,3.74 52.07,-0.07 26.67,-0.07 26.67,2.98 26.8,3.11 31.11,3.11 32,3.99 32,5.01 31.5,5.52 30.61,5.52 28.96,5.52 28.07,6.41 28.07,7.68 28.32,7.93 32.64,7.93 32.89,8.19 32.89,8.31 32.89,9.46 32.77,9.58 27.05,9.58 26.29,8.82 26.16,8.69 26.16,6.03 26.04,5.9 23.11,5.9 22.99,6.03 22.99,9.07 24.51,9.07 25.15,9.71 25.15,10.85 30.1,15.8 32.13,15.8 56.52,15.8
  pour Top (rank 2): 52.07,-0.07 52.07,17.71 48.26,17.71 48.26,15.17 44.45,15.17 43.18,13.9 35.56,13.9 35.56,7.55 31.75,7.55 31.75,3.74 32.38,3.11 34.42,3.11 34.29,2.98 34.29,-0.07
  pour Top (rank 2): 29.21,26.6 19.68,26.6 19.68,30.03 17.78,31.93 17.78,34.22 20.32,36.76 27.94,36.76 30.48,39.3 34.29,39.3 34.29,35.49 31.75,35.49 29.21,32.95
N$3
  Top 0.254: R4.1 22.11,23.78 STM32F001.32
N$4  (via drill 0.35)
  Top 0.254: R6.2 v12.06,36.76
  Bottom 0.254: v12.06,36.76 12.01,36.76 10.74,35.49 U$2.17
N$6
  Top 0.254: R13.1 19.52,22.5 18.67,21.65 18.29,21.65 17.53,20.89 17.53,17.2 17.81,16.92 STM32F001.39
N$71
  Top 0.254: STM32F001.4 21.61,6.64 22.1,6.15 24.32,6.15 24.58,5.9 CRYSTAL.1 25,4.33 CL4.2
N$72
  Top 0.254: STM32F001.3 21.11,6.63 20.38,5.9 CRYSTAL.2 19.95,4.33 CL3.2
N$73
  Top 0.254: 28.06,3.11 28.07,3.11 | 28.07,3.11 31.43,3.11 31.74,2.8 31.74,2.09 32.12,1.71 33.9,1.71 34.15,1.45 LED1.C | STM32F001.11 25.11,10.16 25.78,9.49 25.78,6.53 26.42,5.9 26.42,4.76 28.07,3.11
N$74  (via drill 0.35)
  Top 0.254: R5.2 v12.06,38.79
  Bottom 0.254: U$2.16 11.3,38.03 v12.06,38.79
N$76
  Top 0.254: LED1.A R2.2
NRST1  (via drill 0.35)
  Top 0.254: v22.35,9.71 22.73,9.71 23.11,10.09 STM32F001.7 | U$2.15 10.92,2.47 11.43,2.98 11.43,5.39 13.72,7.68 15.11,7.68 v15.24,7.55
  Bottom 0.254: v22.35,9.71 22.23,9.84 20.83,9.84 18.16,7.17 15.62,7.17 v15.24,7.55
SD_!SW!
  Top 0.254: MICRO_SD.SWA 37.29,4.2 36.25,3.16 32.26,3.16 31.04,4.38 27.94,4.38 27.01,5.3 27.01,6.79 R3.2 26.63,9.27 25.61,10.29 STM32F001.12
SD_MISO
  Top 0.254: STM32F001.27 24.61,20.6 24.89,20.89 29.79,20.89 30.58,20.09 30.58,18.37 31.32,17.63 39.22,17.63 40.29,16.56 MICRO_SD.7
SD_MOSI
  Top 0.254: STM32F001.28 24.11,20.97 24.54,21.39 30.23,21.39 31.37,20.25 31.37,18.73 31.88,18.22 43.18,18.22 44.69,16.71 MICRO_SD.3
SD_SCK
  Top 0.254: STM32F001.26 25.11,20.21 25.27,20.38 29.21,20.38 29.84,19.74 29.84,18.22 30.99,17.07 32.89,17.07 33.15,16.82 33.15,16.19 33.4,15.93 36.7,15.93 38.23,14.41 41.4,14.41 42.49,15.49 MICRO_SD.5
SWCLK1  (via drill 0.35)
  Top 0.254: v13.08,12.5 5.13,12.5 U$2.11 | v19.94,16.57 19.94,17.52 19.54,17.92 STM32F001.37
  Bottom 0.254: v19.94,16.57 19.81,16.69 13.59,16.69 13.21,16.31 13.21,12.63 v13.08,12.5
SWDIO1  (via drill 0.35)
  Top 0.254: v11.81,13.77 11.56,13.77 10.16,15.17 U$2.10 | STM32F001.34 21.11,17.99 v21.08,17.96
  Bottom 0.254: v11.81,13.77 11.81,16.69 13.08,17.96 v21.08,17.96
TWE_!PGM!  (via drill 0.35)
  Top 0.254: STM32F001.40 17.53,16.42 16.92,17.04 16.92,25.87 18.41,27.36 18.41,34.98 19.94,36.51 v26.67,36.51 | TWE-LITE.2 v26.67,38.03
  Bottom 0.254: v26.67,38.03 v26.67,36.51
TWE_!RESET!  (via drill 0.35)
  Top 0.254: R4.2 24.09,25.54 TWE-LITE.21 | R1.2 R4.2 | R4.2 23.96,24.19 v23.5,24.19
  Bottom 0.406: v23.5,24.19 23.37,24.06 11.6,24.06 10.33,25.33 U$2.21
TWE_!RTS!
  Top 0.254: TWE-LITE.7 20.32,38.03 17.78,35.49 17.78,27.47 16.26,25.95 16.26,16.87 17.2,15.92 STM32F001.41
TWE_BPS
  Top 0.254: TWE-LITE.19 21.6,22.52 21.61,22.51 STM32F001.33
TWE_RTX
  Top 0.254: STM32F001.43 16.5,14.92 15.13,16.29 15.13,34.23 13.98,35.38 13.98,37.77 14.82,38.61 R5.1 14.94,38.79 15.33,39.18 18.92,39.18 TWE-LITE.8
TWE_SLEEP  (via drill 0.3, 0.35)
  Top 0.406: v29.07,30.41 TWE-LITE.27 30.48,30.41 32.22,28.67 R12.1 | v17.53,25.58 17.57,25.55 17.57,23.93 R13.2
  Bottom 0.406: v29.07,30.41 29.07,27.11 27.8,25.84 17.78,25.84 v17.53,25.58 15.03,25.58 10.21,30.41 U$2.19
TWE_TRX
  Top 0.254: STM32F001.42 16.86,15.42 15.66,16.62 15.66,36.39 16.03,36.76 TWE-LITE.9 R6.1
VBAT  (via drill 0.35, 0.4)
  Top 0.254: STM32F001.1 20.11,11.91 20.45,12.25 21.46,12.25 v22.35,13.14 | v13.34,30.41 U$2.4 | v19.05,30.28 19.05,27.11 18.22,26.28 18.22,25.01 18.67,24.57 18.67,23.04 v17.65,22.03
  Bottom 0.254: v22.35,13.14 22.99,13.77 22.99,19.49 22.48,20 20.19,20 18.16,22.03 v17.65,22.03 | v19.05,30.28 16.51,30.28 16.38,30.41 v13.34,30.41
VCC  (via drill 0.5)
  Top 0.508: MCP1.3 14.61,1.85 C9.1 14.72,1.96 17.14,1.96 17.78,2.6 v17.78,7.93 | v16.35,14.22 16.26,14.22 14.47,16.01 14.47,33.47 12.45,35.49 U$2.2
  Bottom 0.508: v17.78,7.93 16,7.93 14.61,9.33 14.61,13.77 15.05,14.22 v16.35,14.22
VDD  (via drill 0.35, 0.5, 0.55)
  Top 0.254: STM32F001.36 20.11,20.38 19.74,20.74 C7.1 | STM32F001.9 24.13,11 24.13,9.96 24.51,9.58 24.51,9.06 C12.1 | STM32F001.48 17.82,12.42 17.53,12.12 17.53,10.47 18.27,9.72 C10.1 | STM32F001.24 28.15,17.92 28.43,18.2 C11.1 | R2.1 27.6,2.47 27.42,2.47 27.16,2.47
  Top 0.406: C6.1 34.04,14.27 v34.04,14.66 33.25,15.45 33.2,15.45 32.63,16.02 R10.2 R9.2 29.59,17.46 v29.08,17.96 | R11.2 C5.2 32.37,34.73 v31.24,34.73 | R11.2 32.65,33.16 ES920LR.2 | R12.2 32.04,30.37 31.37,31.05 31.37,32.4 R11.2 | TWE-LITE.5 22.86,38.03 23.62,37.27 27.18,37.27 27.81,37.9 29.08,37.9 30.48,39.3 32.15,39.3 C1.1 v33.26,39.54 v33.27,39.55 | C12.1 24.93,8.64 R3.1 24.93,6.62 25.78,5.77 25.78,3.22 26.42,2.58 C3.1
  Top 0.508: v18.41,9.07 C10.1 | C12.1 v24.51,8.69 | v15.62,11.23 v15.63,11.23 C8.1 15.88,10.28 MCP1.5 | v29.08,17.96 29.08,18.84 C11.1 | EEPROM.8 33.4,11.99 33.4,13.63 C6.1 | MICRO_SD.4 43.59,14.94 41.91,13.27 38.23,13.27 36.44,15.06 C4.1 35.16,15.04 34.42,15.04 v34.04,14.66 | ES920LR.13 32.83,19.18 32.77,19.25 C2.1 v32.38,19.87 | FLASH.8 27.42,2.47 | 27.16,2.47 C3.1 | 33.97,33.16 ES920LR.2
  Top 0.61: v19.68,21.52 19.68,21.51 C7.1 18.68,20.5 v18.16,20.5
  Top 1.016: 11.94,32.95 v13.46,32.95 v13.46,31.43 11.94,32.95 | 11.94,32.95 U$2.3
  Bottom 0.813: 29.08,20.12 v29.08,17.96 29.08,15.8 29.59,16.31 32.38,16.31 | 29.08,20.12 28.45,20.76 20.95,20.76 20.19,21.52 v19.68,21.52 | 29.08,20.12 29.34,19.87 v32.38,19.87 32.38,16.31 | 32.38,16.31 v34.04,14.66 42.67,14.66 44.45,16.44 44.45,32.95 41.91,35.49 32,35.49 | 14.99,31.43 26.92,31.43 30.1,34.6 | 30.23,34.73 30.1,34.6 | 30.1,34.6 30.1,35.49 | 30.1,35.49 30.1,38.92 30.73,39.55 v33.27,39.55 | 30.1,34.6 31.11,34.6 v31.24,34.73 32,35.49 | 32,35.49 30.1,35.49
  Bottom 1.016: v24.51,8.69 24.51,10.22 24,10.72 | 24,10.72 20.45,10.72 18.8,9.07 v18.41,9.07 16.26,9.07 15.62,9.71 v15.62,11.23 | 29.08,15.8 24,10.72 | v13.46,32.95 v13.46,31.43 14.99,31.43 v13.46,32.95
  pour Bottom (rank 2): 32.38,16.31 29.21,16.31 29.21,19.74 32.38,19.74

### Text on the board
Top: WASA Rocket Project
tNames: Communication & Logging Module
tStop: WASA Rocket Project
bStop: Designed by @fujiy0, 2019